# Altium project prj.PrjPcb
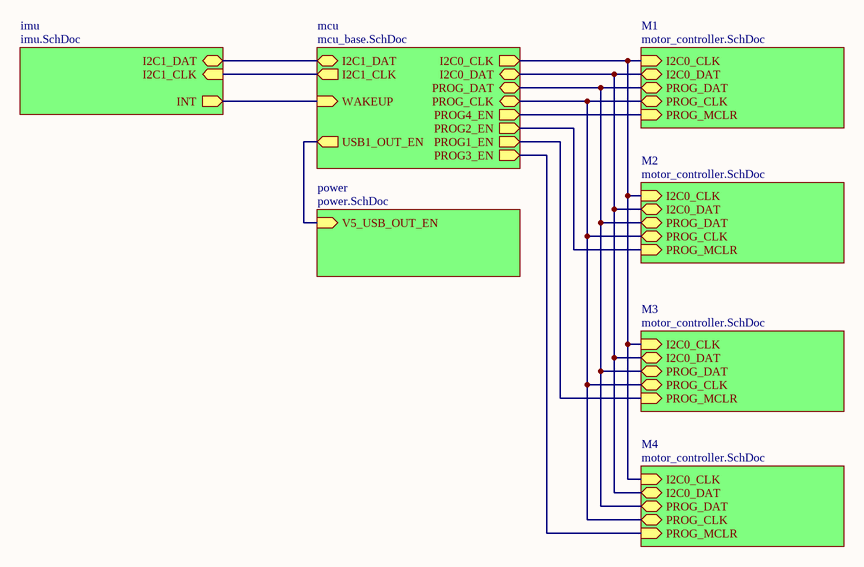
[diagram p0: top.SchDoc]
5 sheets, 197 parts. Net scope: hierarchical (ports join the sheet entries above them; power ports are global).
Board file: daboard.PcbDoc
Sheets:
  top.SchDoc
    M1 = motor_controller.SchDoc
    mcu = mcu_base.SchDoc
    imu = imu.SchDoc
    power = power.SchDoc
    M2 = motor_controller.SchDoc
    M3 = motor_controller.SchDoc
    M4 = motor_controller.SchDoc

## Sheet top.SchDoc
size Letter

### Sub-sheets
imu = imu.SchDoc: I2C1_DAT (bidir), I2C1_CLK (in), INT (out)
M1 = motor_controller.SchDoc: I2C0_CLK (in), I2C0_DAT (bidir), PROG_DAT (bidir), PROG_CLK (bidir), PROG_MCLR (in)
M2 = motor_controller.SchDoc: I2C0_CLK (in), I2C0_DAT (bidir), PROG_DAT (bidir), PROG_CLK (bidir), PROG_MCLR (in)
M3 = motor_controller.SchDoc: I2C0_CLK (in), I2C0_DAT (bidir), PROG_DAT (bidir), PROG_CLK (bidir), PROG_MCLR (in)
M4 = motor_controller.SchDoc: I2C0_CLK (in), I2C0_DAT (bidir), PROG_DAT (bidir), PROG_CLK (bidir), PROG_MCLR (in)
mcu = mcu_base.SchDoc: I2C1_CLK (out), I2C1_DAT (bidir), I2C0_DAT (bidir), I2C0_CLK (out), USB1_OUT_EN (out), PROG1_EN (out), PROG2_EN (out), PROG3_EN (out), PROG4_EN (out), PROG_DAT (bidir), PROG_CLK (bidir), WAKEUP (in)
power = power.SchDoc: V5_USB_OUT_EN (in)

### Nets
NetR11A_2: sheet M1/PROG_MCLR, sheet mcu/PROG4_EN
NetR11B_2: sheet mcu/PROG2_EN, sheet M2/PROG_MCLR
NetR11C_2: sheet mcu/PROG1_EN, sheet M3/PROG_MCLR
NetR11D_2: sheet mcu/PROG3_EN, sheet M4/PROG_MCLR
NetR31_2: sheet mcu/USB1_OUT_EN, sheet power/V5_USB_OUT_EN
NetR32_1: sheet mcu/I2C1_DAT, sheet imu/I2C1_DAT
NetR33_1: sheet mcu/I2C1_CLK, sheet imu/I2C1_CLK
NetR34_1: sheet M1/I2C0_CLK, sheet mcu/I2C0_CLK, sheet M2/I2C0_CLK, sheet M3/I2C0_CLK, sheet M4/I2C0_CLK
NetR35_1: sheet M1/I2C0_DAT, sheet mcu/I2C0_DAT, sheet M2/I2C0_DAT, sheet M3/I2C0_DAT, sheet M4/I2C0_DAT
NetU2_50: sheet M1/PROG_DAT, sheet mcu/PROG_DAT, sheet M2/PROG_DAT, sheet M3/PROG_DAT, sheet M4/PROG_DAT
NetU2_51: sheet M1/PROG_CLK, sheet mcu/PROG_CLK, sheet M2/PROG_CLK, sheet M3/PROG_CLK, sheet M4/PROG_CLK
NetU2_130: sheet mcu/WAKEUP, sheet imu/INT

## Sheet motor_controller.SchDoc: Brushless Motor Controller
size Letter
Used 4 times, as channels M1, M2, M3, M4. Parts and nets are listed once, with the designators drawn on the sheet.
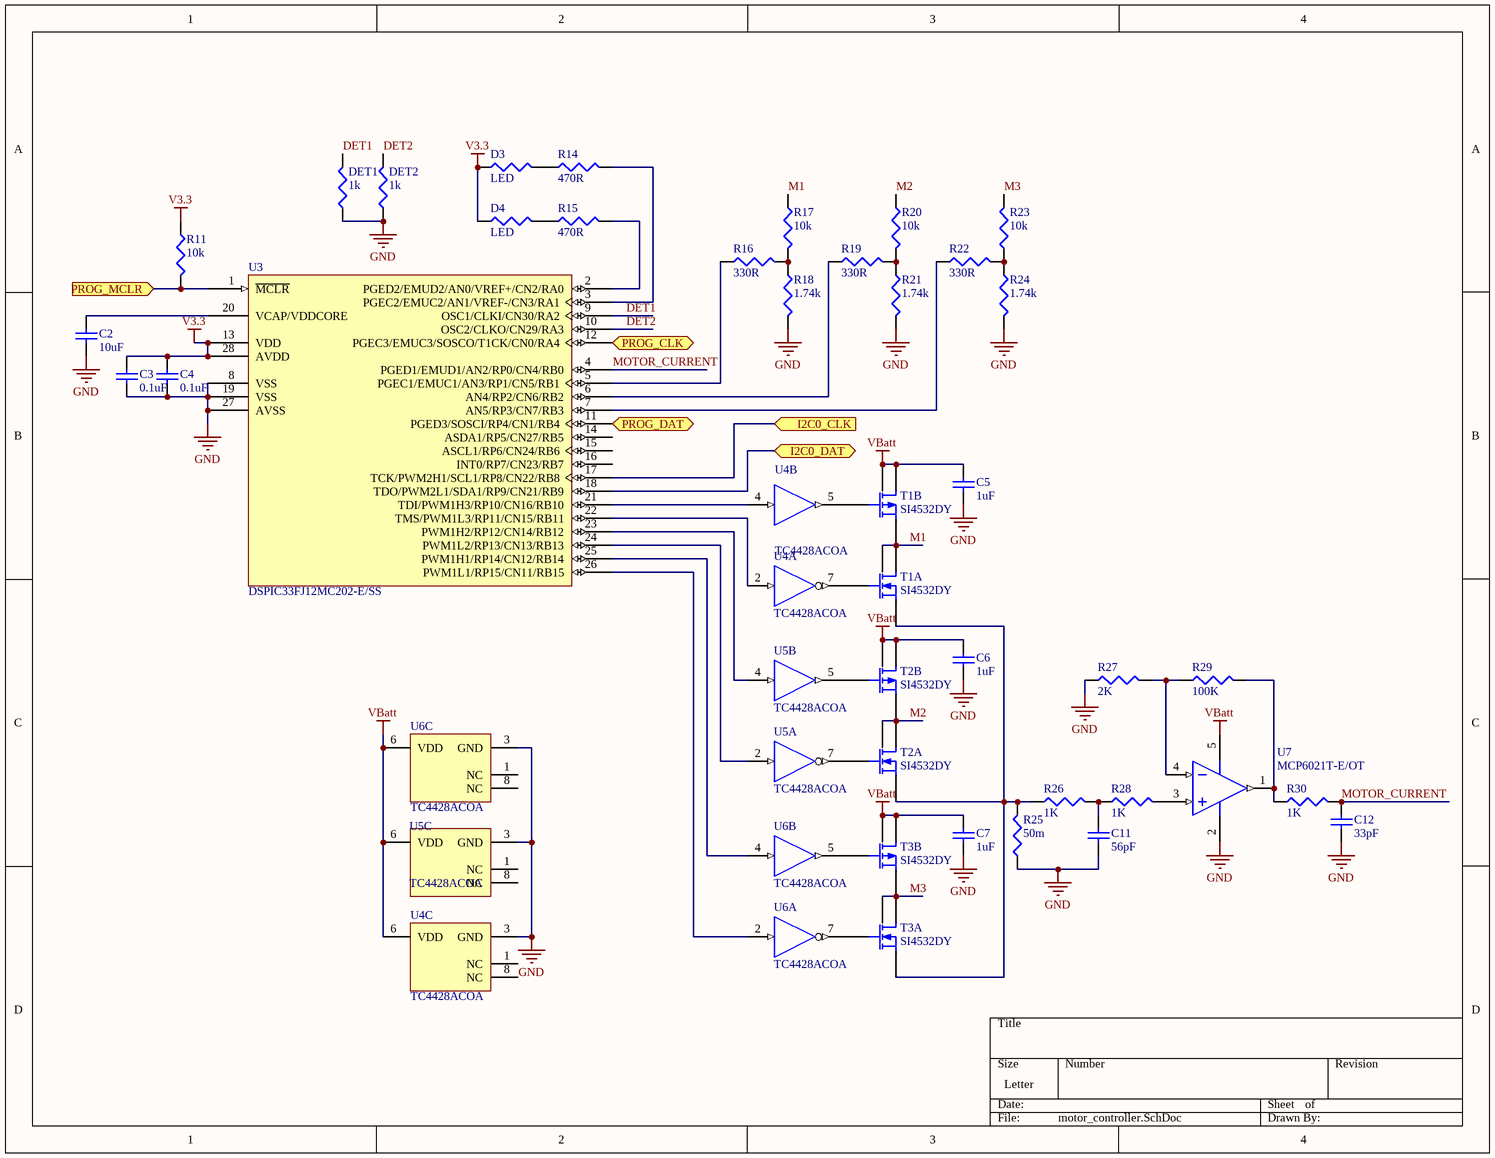
[diagram p1: motor_controller.SchDoc]

### Parts
C2  10uF  [1608[0603]]
C3  0.1uF  [1608[0603]]
C4  0.1uF  [1608[0603]]
C5  1uF  [1608[0603]]
C6  1uF  [1608[0603]]
C7  1uF  [1608[0603]]
C11  56pF  [1608[0603]]
C12  33pF  [1608[0603]]
D3  LED  [J1-0603]
D4  LED  [J1-0603]
DET1  1k  [J1-0603]
DET2  1k  [J1-0603]
R11  10k  [J1-0603]
R14  470R  [J1-0603]
R15  470R  [J1-0603]
R16  330R  [J1-0603]
R17  10k  [J1-0603]
R18  1.74k  [J1-0603]
R19  330R  [J1-0603]
R20  10k  [J1-0603]
R21  1.74k  [J1-0603]
R22  330R  [J1-0603]
R23  10k  [J1-0603]
R24  1.74k  [J1-0603]
R25  50m  [14-1210]
R26  1K  [J1-0603]
R27  2K  [J1-0603]
R28  1K  [J1-0603]
R29  100K  [J1-0603]
R30  1K  [J1-0603]
T1  SI4532DY  [SOIC127P600-8L]  (parts A,B of 2)
T2  SI4532DY  [SOIC127P600-8L]  (parts A,B of 2)
T3  SI4532DY  [SOIC127P600-8L]  (parts A,B of 2)
U3  DSPIC33FJ12MC202-E/SS  [SSOP-SS28_N]
U4  TC4428ACOA  [SOIC-OA8_N]  (parts A,B,C of 3)
U5  TC4428ACOA  [SOIC-OA8_N]  (parts A,B,C of 3)
U6  TC4428ACOA  [SOIC-OA8_N]  (parts A,B,C of 3)
U7  MCP6021T-E/OT  [SOT-23-OT5_N]

### Ports
I2C0_CLK (in), I2C0_DAT (bidir), PROG_CLK (bidir), PROG_DAT (bidir), PROG_MCLR (in)

### Nets
GND: C2.1 C3.1 C4.1 C5.1 C6.1 C7.1 C11.1 C12.1 DET1.1 DET2.1 R18.2 R21.2 R24.2 R25.1 R27.1 U3.8(VSS) U3.19(VSS) U3.27(AVSS) U4.3(GND) U5.3(GND) U6.3(GND) U7.2(VSS)
V3.3: C3.2 C4.2 D3.1 D4.1 R11.1 U3.13(VDD) U3.28(AVDD)
VBatt: C5.2 C6.2 C7.2 T1.5(D2) T1.6(D2) T2.5(D2) T2.6(D2) T3.5(D2) T3.6(D2) U4.6(VDD) U5.6(VDD) U6.6(VDD) U7.5(VDD)
DET1: DET1.2 U3.9(OSC1/CLKI/CN30/RA2)
DET2: DET2.2 U3.10(OSC2/CLKO/CN29/RA3)
I2C0_CLK: U3.17(TCK/PWM2H1/SCL1/RP8/CN22/RB8) ; port I2C0_CLK
I2C0_DAT: U3.18(TDO/PWM2L1/SDA1/RP9/CN21/RB9) ; port I2C0_DAT
M1: R17.1 T1.3(S2) T1.7(D1) T1.8(D1)
M2: R20.1 T2.3(S2) T2.7(D1) T2.8(D1)
M3: R23.2 T3.3(S2) T3.7(D1) T3.8(D1)
MOTOR_CURRENT: C12.2 R30.2 U3.4(PGED1/EMUD1/AN2/RP0/CN4/RB0)
PROG_CLK: U3.12(PGEC3/EMUC3/SOSCO/T1CK/CN0/RA4) ; port PROG_CLK
PROG_DAT: U3.11(PGED3/SOSCI/RP4/CN1/RB4) ; port PROG_DAT
PROG_MCLR: R11.2 U3.1(~{MCLR}) ; port PROG_MCLR
NetC2_2: C2.2 U3.20(VCAP/VDDCORE)
NetC11_2: C11.2 R26.2 R28.1
NetD3_2: D3.2 R14.1
NetD4_2: D4.2 R15.1
NetR14_2: R14.2 U3.3(PGEC2/EMUC2/AN1/VREF-/CN3/RA1)
NetR15_2: R15.2 U3.2(PGED2/EMUD2/AN0/VREF+/CN2/RA0)
NetR16_1: R16.1 U3.5(PGEC1/EMUC1/AN3/RP1/CN5/RB1)
NetR16_2: R16.2 R17.2 R18.1
NetR19_1: R19.1 U3.6(AN4/RP2/CN6/RB2)
NetR19_2: R19.2 R20.2 R21.1
NetR22_1: R22.1 U3.7(AN5/RP3/CN7/RB3)
NetR22_2: R22.2 R23.1 R24.1
NetR25_2: R25.2 R26.1 T1.1(S1) T2.1(S1) T3.1(S1)
NetR27_2: R27.2 R29.1 U7.4(VIN-)
NetR28_2: R28.2 U7.3(VIN+)
NetR29_2: R29.2 R30.1 U7.1(VOUT)
NetT1_2: T1.2(G1) U4.7(~{OUTA})
NetT1_4: T1.4(G2) U4.5(OUTB)
NetT2_2: T2.2(G1) U5.7(~{OUTA})
NetT2_4: T2.4(G2) U5.5(OUTB)
NetT3_2: T3.2(G1) U6.7(~{OUTA})
NetT3_4: T3.4(G2) U6.5(OUTB)
NetU3_21: U3.21(TDI/PWM1H3/RP10/CN16/RB10) U4.4(INB)
NetU3_22: U3.22(TMS/PWM1L3/RP11/CN15/RB11) U4.2(INA)
NetU3_23: U3.23(PWM1H2/RP12/CN14/RB12) U5.4(INB)
NetU3_24: U3.24(PWM1L2/RP13/CN13/RB13) U5.2(INA)
NetU3_25: U3.25(PWM1H1/RP14/CN12/RB14) U6.4(INB)
NetU3_26: U3.26(PWM1L1/RP15/CN11/RB15) U6.2(INA)

Not connected (* = marked no-connect by the designer): U3 14(ASDA1/RP5/CN27/RB5) 15(ASCL1/RP6/CN24/RB6) 16(INT0/RP7/CN23/RB7); U4 1(NC) 8(NC); U5 1(NC) 8(NC); U6 1(NC) 8(NC)

### Channels
M1: designators end in A; ports I2C0_CLK=NetR34_1 I2C0_DAT=NetR35_1 PROG_CLK=NetU2_51 PROG_DAT=NetU2_50 PROG_MCLR=NetR11A_2
M2: designators end in B; ports I2C0_CLK=NetR34_1 I2C0_DAT=NetR35_1 PROG_CLK=NetU2_51 PROG_DAT=NetU2_50 PROG_MCLR=NetR11B_2
M3: designators end in C; ports I2C0_CLK=NetR34_1 I2C0_DAT=NetR35_1 PROG_CLK=NetU2_51 PROG_DAT=NetU2_50 PROG_MCLR=NetR11C_2
M4: designators end in D; ports I2C0_CLK=NetR34_1 I2C0_DAT=NetR35_1 PROG_CLK=NetU2_51 PROG_DAT=NetU2_50 PROG_MCLR=NetR11D_2

### Library data of the parts
C2-C7 C11 C12 = Cap Semi: Capacitor (Semiconductor SIM Model); Value: 100pF; Published: 8-Jun-2000; LatestRevisionDate: 29-May-2009; LatestRevisionNote: IPC-7351 Footprint Added.; PackageReference: C1206; Publisher: Altium Limited; PackageDescription: Chip Capacitor
D3 D4 R11 R14-R25 R27 R29 = Res3: Resistor; Value: 1K; Published: 8-Jun-2000; LatestRevisionDate: 29-May-2009; LatestRevisionNote: IPC-7351 Footprint Added.; PackageReference: J1-0603; Publisher: Altium Limited; PackageDescription: Chip Resistor
DET1 DET2 R26 R28 R30 = Res3: Resistor; Published: 8-Jun-2000; LatestRevisionDate: 29-May-2009; LatestRevisionNote: IPC-7351 Footprint Added.; PackageReference: J1-0603; Publisher: Altium Limited; PackageDescription: Chip Resistor; Value: 1K
U3 = DSPIC33FJ12MC202-E/SS: High-Performance 16-bit Digital Signal Controller, 12 KB Flash, 1 KB RAM, 28-Pin SSOP, Extended High Temperature; DatasheetVersion: revD, Jun-2009; PackageVersion: revBB, Aug-2009; PackageReference: SSOP-SS28; PackageDescription: 28-Lead Plastic Shrink Small Outline (SS) - 5.3mm Body [SSOP]; Code_JEDEC: MS-150; ComponentLink1Description: Manufacturer URL; ComponentLink1URL: http://www.microchip.com/; ComponentLink2Description: Datasheet; ComponentLink2URL: http://ww1.microchip.com/downloads/en/DeviceDoc/70265D.pdf; ComponentLink3Description: Package Specification; ComponentLink3URL: http://www.microchip.com/stellent/groups/techpub_sg/documents/packagingspec/en012702.pdf
U4-U6 = TC4428ACOA: 1.5A Dual High-Speed Power MOSFET Driver, Complementary, Commercial Temperature; DatasheetVersion: revF, Jan-2006; PackageVersion: revBB, Aug-2009; PackageReference: SOIC-OA8; PackageDescription: 8-Lead Plastic Small Outline (OA) - Narrow, 3.90mm Body [SOIC]; Code_IPC: SOIC127P600-8; ComponentLink1Description: Manufacturer URL; ComponentLink1URL: http://www.microchip.com/; ComponentLink2Description: Datasheet; ComponentLink2URL: http://ww1.microchip.com/downloads/en/DeviceDoc/21423F.pdf; ComponentLink3Description: Package Specification; ComponentLink3URL: http://www.microchip.com/stellent/groups/techpub_sg/documents/packagingspec/en012702.pdf
U7 = MCP6021T-E/OT: Rail-to-Rail Input/Output, 10 MHz Operational Amplifier, 5-Pin SOT-23, Extended Temperature, Tape and Reel; DatasheetVersion: revD, Feb-2009; PackageVersion: revBB, Aug-2009; PackageReference: SOT-23-OT5; PackageDescription: 5-Lead Plastic Small Outline Transistor (OT) [SOT-23]; Code_IPC: SOT23-5; ComponentLink1Description: Manufacturer URL; ComponentLink1URL: http://www.microchip.com/; ComponentLink2Description: Datasheet; ComponentLink2URL: http://ww1.microchip.com/downloads/en/DeviceDoc/21685d.pdf; ComponentLink3Description: Package Specification; ComponentLink3URL: http://www.microchip.com/stellent/groups/techpub_sg/documents/packagingspec/en012702.pdf

## Sheet mcu_base.SchDoc
size Letter
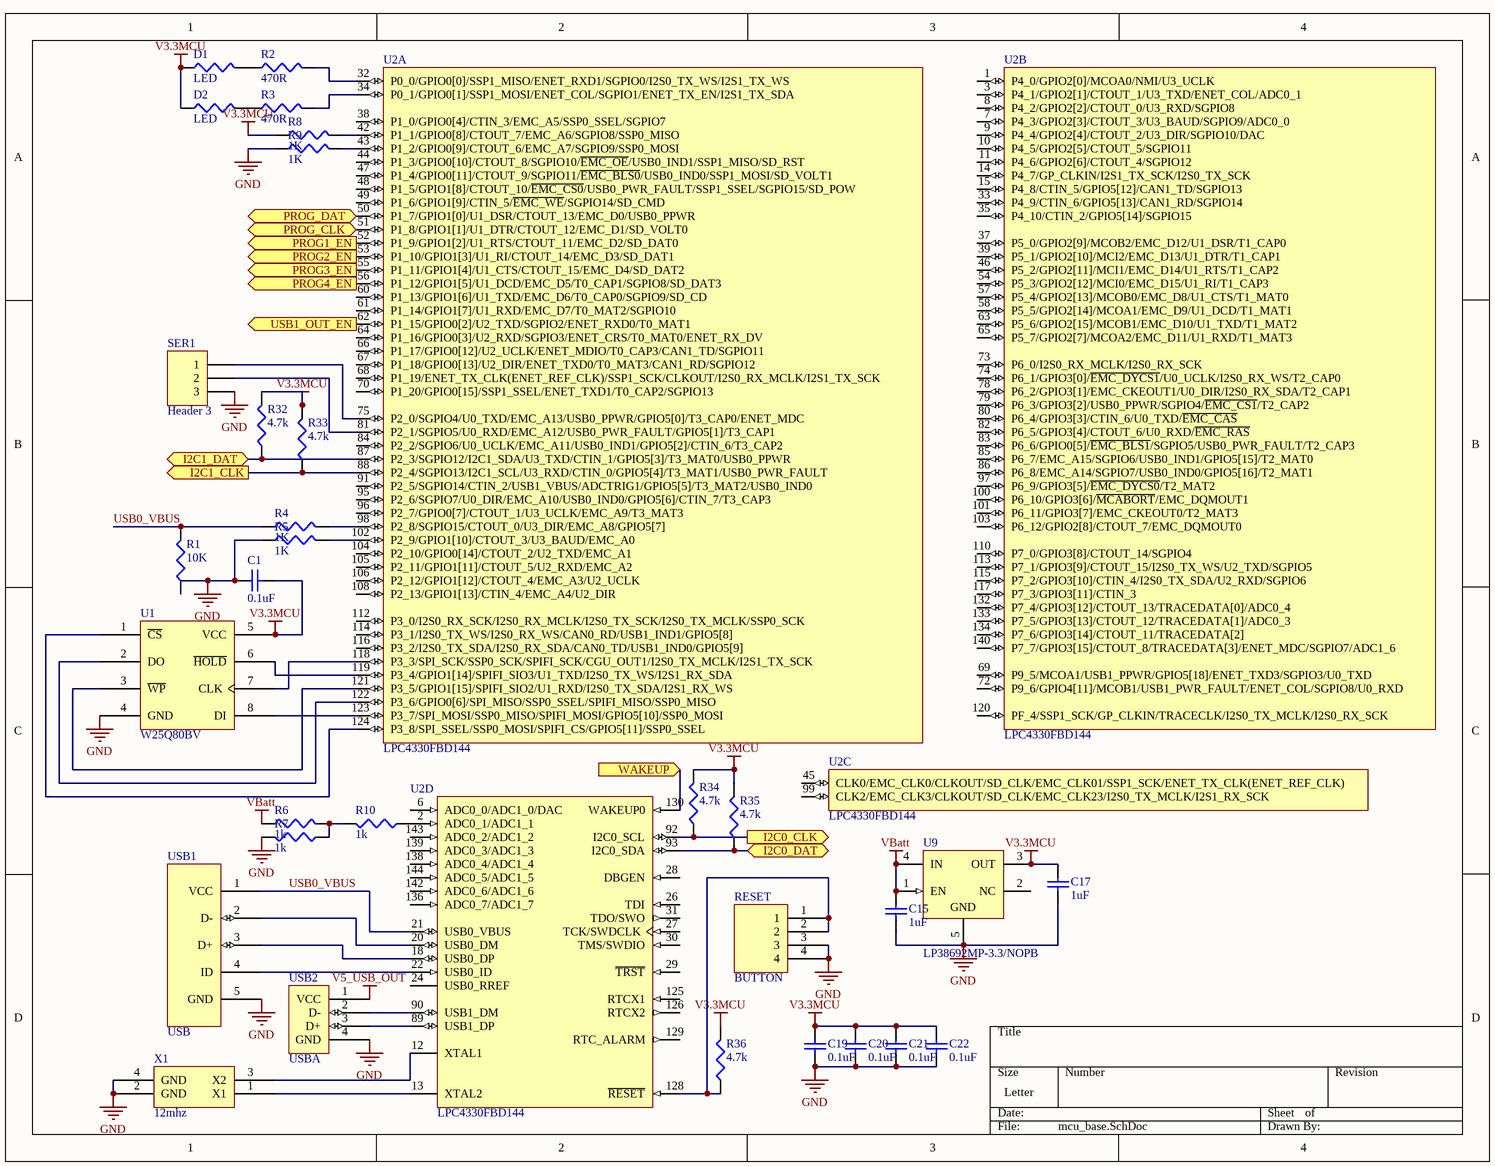
[diagram p2: mcu_base.SchDoc]

### Parts
C1  0.1uF  [1608[0603]]
C15  1uF  [1608[0603]]
C17  1uF  [1608[0603]]
C19  0.1uF  [1608[0603]]
C20  0.1uF  [1608[0603]]
C21  0.1uF  [1608[0603]]
C22  0.1uF  [1608[0603]]
D1  LED  [J1-0603]
D2  LED  [J1-0603]
R1  10K  [J1-0603]
R2  470R  [J1-0603]
R3  470R  [J1-0603]
R4  1K  [J1-0603]
R5  1K  [J1-0603]
R6  1k  [J1-0603]
R7  1k  [J1-0603]
R8  1K  [J1-0603]
R9  1K  [J1-0603]
R10  1k  [J1-0603]
R32  4.7k  [J1-0603]
R33  4.7k  [J1-0603]
R34  4.7k  [J1-0603]
R35  4.7k  [J1-0603]
R36  4.7k  [J1-0603]
RESET  BUTTON  [B3FS_SWITCH]
SER1  Header 3  [HDR1X3]
U1  W25Q80BV  [D8_N]
U2  LPC4330FBD144  [SOT486-1_V]  (parts A,B,C,D of 5)
U9  LP38692MP-3.3/NOPB  [MP05A_N]
USB1  USB  [USB/SM0.8-6H5]
USB2  USBA  [USB2.5-2V4A]
X1  12mhz  [2SMX-3SMXB]

### Ports
I2C0_CLK (out), I2C0_DAT (bidir), I2C1_CLK (out), I2C1_DAT (bidir), PROG1_EN (out), PROG2_EN (out), PROG3_EN (out), PROG4_EN (out), PROG_CLK (bidir), PROG_DAT (bidir), USB1_OUT_EN (out), WAKEUP (in)

### Nets
GND: C1.1 C15.1 C17.1 C19.1 C20.1 C21.1 C22.1 R1.1 R5.1 R7.2 R9.1 RESET.3 RESET.4 SER1.3 U1.4(GND) U9.5(GND) USB1.5(GND) USB2.4(GND) X1.2(GND) X1.4(GND)
V3.3MCU: C1.2 C17.2 C19.2 C20.2 C21.2 C22.2 D1.1 D2.1 R8.1 R32.2 R33.2 R34.2 R35.2 R36.2 U1.5(VCC) U9.3(OUT)
V5_USB_OUT: USB2.1(VCC)
VBatt: C15.2 R6.1 U9.1(EN) U9.4(IN)
USB0_VBUS: R1.2 R4.1 U2.21(USB0_VBUS) USB1.1(VCC)
NetD1_2: D1.2 R2.1
NetD2_2: D2.2 R3.1
NetR2_2: R2.2 U2.32(P0_0/GPIO0[0]/SSP1_MISO/ENET_RXD1/SGPIO0/I2S0_TX_WS/I2S1_TX_WS)
NetR3_2: R3.2 U2.34(P0_1/GPIO0[1]/SSP1_MOSI/ENET_COL/SGPIO1/ENET_TX_EN/I2S1_TX_SDA)
NetR4_2: R4.2 U2.98(P2_8/SGPIO15/CTOUT_0/U3_DIR/EMC_A8/GPIO5[7])
NetR5_2: R5.2 U2.102(P2_9/GPIO1[10]/CTOUT_3/U3_BAUD/EMC_A0)
NetR6_2: R6.2 R7.1 R10.2
NetR8_2: R8.2 U2.42(P1_1/GPIO0[8]/CTOUT_7/EMC_A6/SGPIO8/SSP0_MISO)
NetR9_2: R9.2 U2.43(P1_2/GPIO0[9]/CTOUT_6/EMC_A7/SGPIO9/SSP0_MOSI)
NetR10_1: R10.1 U2.2(ADC0_1/ADC1_1)
NetR11A_2: U2.56(P1_12/GPIO1[5]/U1_DCD/EMC_D5/T0_CAP1/SGPIO8/SD_DAT3) ; port PROG4_EN
NetR11B_2: U2.53(P1_10/GPIO1[3]/U1_RI/CTOUT_14/EMC_D3/SD_DAT1) ; port PROG2_EN
NetR11C_2: U2.52(P1_9/GPIO1[2]/U1_RTS/CTOUT_11/EMC_D2/SD_DAT0) ; port PROG1_EN
NetR11D_2: U2.55(P1_11/GPIO1[4]/U1_CTS/CTOUT_15/EMC_D4/SD_DAT2) ; port PROG3_EN
NetR31_2: U2.62(P1_15/GPIO0[2]/U2_TXD/SGPIO2/ENET_RXD0/T0_MAT1) ; port USB1_OUT_EN
NetR32_1: R32.1 U2.87(P2_3/SGPIO12/I2C1_SDA/U3_TXD/CTIN_1/GPIO5[3]/T3_MAT0/USB0_PPWR) ; port I2C1_DAT
NetR33_1: R33.1 U2.88(P2_4/SGPIO13/I2C1_SCL/U3_RXD/CTIN_0/GPIO5[4]/T3_MAT1/USB0_PWR_FAULT) ; port I2C1_CLK
NetR34_1: R34.1 U2.92(I2C0_SCL) ; port I2C0_CLK
NetR35_1: R35.1 U2.93(I2C0_SDA) ; port I2C0_DAT
NetR36_1: R36.1 RESET.1 RESET.2 U2.128(~{RESET})
NetSER1_1: SER1.1 U2.75(P2_0/SGPIO4/U0_TXD/EMC_A13/USB0_PPWR/GPIO5[0]/T3_CAP0/ENET_MDC)
NetSER1_2: SER1.2 U2.81(P2_1/SGPIO5/U0_RXD/EMC_A12/USB0_PWR_FAULT/GPIO5[1]/T3_CAP1)
NetU1_1: U1.1(~{CS}) U2.124(P3_8/SPI_SSEL/SSP0_MOSI/SPIFI_CS/GPIO5[11]/SSP0_SSEL)
NetU1_2: U1.2(DO) U2.122(P3_6/GPIO0[6]/SPI_MISO/SSP0_SSEL/SPIFI_MISO/SSP0_MISO)
NetU1_3: U1.3(~{WP}) U2.121(P3_5/GPIO1[15]/SPIFI_SIO2/U1_RXD/I2S0_TX_SDA/I2S1_RX_WS)
NetU1_6: U1.6(~{HOLD}) U2.119(P3_4/GPIO1[14]/SPIFI_SIO3/U1_TXD/I2S0_TX_WS/I2S1_RX_SDA)
NetU1_7: U1.7(CLK) U2.118(P3_3/SPI_SCK/SSP0_SCK/SPIFI_SCK/CGU_OUT1/I2S0_TX_MCLK/I2S1_TX_SCK)
NetU1_8: U1.8(DI) U2.123(P3_7/SPI_MOSI/SSP0_MISO/SPIFI_MOSI/GPIO5[10]/SSP0_MOSI)
NetU2_12: U2.12(XTAL1) X1.3(X2)
NetU2_13: U2.13(XTAL2) X1.1(X1)
NetU2_18: U2.18(USB0_DP) USB1.3(D+)
NetU2_20: U2.20(USB0_DM) USB1.2(D-)
NetU2_22: U2.22(USB0_ID) USB1.4(ID)
NetU2_50: U2.50(P1_7/GPIO1[0]/U1_DSR/CTOUT_13/EMC_D0/USB0_PPWR) ; port PROG_DAT
NetU2_51: U2.51(P1_8/GPIO1[1]/U1_DTR/CTOUT_12/EMC_D1/SD_VOLT0) ; port PROG_CLK
NetU2_89: U2.89(USB1_DP) USB2.3(D+)
NetU2_90: U2.90(USB1_DM) USB2.2(D-)
NetU2_130: U2.130(WAKEUP0) ; port WAKEUP

Not connected (* = marked no-connect by the designer): U2 1(P4_0/GPIO2[0]/MCOA0/NMI/U3_UCLK) 3(P4_1/GPIO2[1]/CTOUT_1/U3_TXD/ENET_COL/ADC0_1) 6(ADC0_0/ADC1_0/DAC) 7(P4_3/GPIO2[3]/CTOUT_3/U3_BAUD/SGPIO9/ADC0_0) 8(P4_2/GPIO2[2]/CTOUT_0/U3_RXD/SGPIO8) 9(P4_4/GPIO2[4]/CTOUT_2/U3_DIR/SGPIO10/DAC) 10(P4_5/GPIO2[5]/CTOUT_5/SGPIO11) 11(P4_6/GPIO2[6]/CTOUT_4/SGPIO12) 14(P4_7/GP_CLKIN/I2S1_TX_SCK/I2S0_TX_SCK) 15(P4_8/CTIN_5/GPIO5[12]/CAN1_TD/SGPIO13) 24(USB0_RREF) 26(TDI) 27(TCK/SWDCLK) 28(DBGEN) 29(~{TRST}) 30(TMS/SWDIO) 31(TDO/SWO) 33(P4_9/CTIN_6/GPIO5[13]/CAN1_RD/SGPIO14) 35(P4_10/CTIN_2/GPIO5[14]/SGPIO15) 37(P5_0/GPIO2[9]/MCOB2/EMC_D12/U1_DSR/T1_CAP0) 38(P1_0/GPIO0[4]/CTIN_3/EMC_A5/SSP0_SSEL/SGPIO7) 39(P5_1/GPIO2[10]/MCI2/EMC_D13/U1_DTR/T1_CAP1) 44(P1_3/GPIO0[10]/CTOUT_8/SGPIO10/~{EMC_OE}/USB0_IND1/SSP1_MISO/SD_RST) 45(CLK0/EMC_CLK0/CLKOUT/SD_CLK/EMC_CLK01/SSP1_SCK/ENET_TX_CLK(ENET_REF_CLK)) 46(P5_2/GPIO2[11]/MCI1/EMC_D14/U1_RTS/T1_CAP2) 47(P1_4/GPIO0[11]/CTOUT_9/SGPIO11/~{EMC_BLS0}/USB0_IND0/SSP1_MOSI/SD_VOLT1) 48(P1_5/GPIO1[8]/CTOUT_10/~{EMC_CS0}/USB0_PWR_FAULT/SSP1_SSEL/SGPIO15/SD_POW) 49(P1_6/GPIO1[9]/CTIN_5/~{EMC_WE}/SGPIO14/SD_CMD) 54(P5_3/GPIO2[12]/MCI0/EMC_D15/U1_RI/T1_CAP3) 57(P5_4/GPIO2[13]/MCOB0/EMC_D8/U1_CTS/T1_MAT0) 58(P5_5/GPIO2[14]/MCOA1/EMC_D9/U1_DCD/T1_MAT1) 60(P1_13/GPIO1[6]/U1_TXD/EMC_D6/T0_CAP0/SGPIO9/SD_CD) 61(P1_14/GPIO1[7]/U1_RXD/EMC_D7/T0_MAT2/SGPIO10) 63(P5_6/GPIO2[15]/MCOB1/EMC_D10/U1_TXD/T1_MAT2) 64(P1_16/GPIO0[3]/U2_RXD/SGPIO3/ENET_CRS/T0_MAT0/ENET_RX_DV) 65(P5_7/GPIO2[7]/MCOA2/EMC_D11/U1_RXD/T1_MAT3) 66(P1_17/GPIO0[12]/U2_UCLK/ENET_MDIO/T0_CAP3/CAN1_TD/SGPIO11) 67(P1_18/GPIO0[13]/U2_DIR/ENET_TXD0/T0_MAT3/CAN1_RD/SGPIO12) 68(P1_19/ENET_TX_CLK(ENET_REF_CLK)/SSP1_SCK/CLKOUT/I2S0_RX_MCLK/I2S1_TX_SCK) 69(P9_5/MCOA1/USB1_PPWR/GPIO5[18]/ENET_TXD3/SGPIO3/U0_TXD) 70(P1_20/GPIO0[15]/SSP1_SSEL/ENET_TXD1/T0_CAP2/SGPIO13) 72(P9_6/GPIO4[11]/MCOB1/USB1_PWR_FAULT/ENET_COL/SGPIO8/U0_RXD) 73(P6_0/I2S0_RX_MCLK/I2S0_RX_SCK) 74(P6_1/GPIO3[0]/~{EMC_DYCS1}/U0_UCLK/I2S0_RX_WS/T2_CAP0) 78(P6_2/GPIO3[1]/EMC_CKEOUT1/U0_DIR/I2S0_RX_SDA/T2_CAP1) 79(P6_3/GPIO3[2]/USB0_PPWR/SGPIO4/~{EMC_CS1}/T2_CAP2) 80(P6_4/GPIO3[3]/CTIN_6/U0_TXD/~{EMC_CAS}) 82(P6_5/GPIO3[4]/CTOUT_6/U0_RXD/~{EMC_RAS}) 83(P6_6/GPIO0[5]/~{EMC_BLS1}/SGPIO5/USB0_PWR_FAULT/T2_CAP3) 84(P2_2/SGPIO6/U0_UCLK/EMC_A11/USB0_IND1/GPIO5[2]/CTIN_6/T3_CAP2) 85(P6_7/EMC_A15/SGPIO6/USB0_IND1/GPIO5[15]/T2_MAT0) 86(P6_8/EMC_A14/SGPIO7/USB0_IND0/GPIO5[16]/T2_MAT1) 91(P2_5/SGPIO14/CTIN_2/USB1_VBUS/ADCTRIG1/GPIO5[5]/T3_MAT2/USB0_IND0) 95(P2_6/SGPIO7/U0_DIR/EMC_A10/USB0_IND0/GPIO5[6]/CTIN_7/T3_CAP3) 96(P2_7/GPIO0[7]/CTOUT_1/U3_UCLK/EMC_A9/T3_MAT3) 97(P6_9/GPIO3[5]/~{EMC_DYCS0}/T2_MAT2) 99(CLK2/EMC_CLK3/CLKOUT/SD_CLK/EMC_CLK23/I2S0_TX_MCLK/I2S1_RX_SCK) 100(P6_10/GPIO3[6]/~{MCABORT}/EMC_DQMOUT1) 101(P6_11/GPIO3[7]/EMC_CKEOUT0/T2_MAT3) 103(P6_12/GPIO2[8]/CTOUT_7/EMC_DQMOUT0) 104(P2_10/GPIO0[14]/CTOUT_2/U2_TXD/EMC_A1) 105(P2_11/GPIO1[11]/CTOUT_5/U2_RXD/EMC_A2) 106(P2_12/GPIO1[12]/CTOUT_4/EMC_A3/U2_UCLK) 108(P2_13/GPIO1[13]/CTIN_4/EMC_A4/U2_DIR) 110(P7_0/GPIO3[8]/CTOUT_14/SGPIO4) 112(P3_0/I2S0_RX_SCK/I2S0_RX_MCLK/I2S0_TX_SCK/I2S0_TX_MCLK/SSP0_SCK) 113(P7_1/GPIO3[9]/CTOUT_15/I2S0_TX_WS/U2_TXD/SGPIO5) 114(P3_1/I2S0_TX_WS/I2S0_RX_WS/CAN0_RD/USB1_IND1/GPIO5[8]) 115(P7_2/GPIO3[10]/CTIN_4/I2S0_TX_SDA/U2_RXD/SGPIO6) 116(P3_2/I2S0_TX_SDA/I2S0_RX_SDA/CAN0_TD/USB1_IND0/GPIO5[9]) 117(P7_3/GPIO3[11]/CTIN_3) 120(PF_4/SSP1_SCK/GP_CLKIN/TRACECLK/I2S0_TX_MCLK/I2S0_RX_SCK) 125(RTCX1) 126(RTCX2) 129(RTC_ALARM) 132(P7_4/GPIO3[12]/CTOUT_13/TRACEDATA[0]/ADC0_4) 133(P7_5/GPIO3[13]/CTOUT_12/TRACEDATA[1]/ADC0_3) 134(P7_6/GPIO3[14]/CTOUT_11/TRACEDATA[2]) 136(ADC0_7/ADC1_7) 138(ADC0_4/ADC1_4) 139(ADC0_3/ADC1_3) 140(P7_7/GPIO3[15]/CTOUT_8/TRACEDATA[3]/ENET_MDC/SGPIO7/ADC1_6) 142(ADC0_6/ADC1_6) 143(ADC0_2/ADC1_2) 144(ADC0_5/ADC1_5); U9 2(NC)

### Library data of the parts
C1 C15 C17 C19-C22 = Cap Semi: as C2 on sheet motor_controller; Published: 8-Jun-2000; LatestRevisionDate: 29-May-2009; LatestRevisionNote: IPC-7351 Footprint Added.; PackageReference: C1206; Publisher: Altium Limited; PackageDescription: Chip Capacitor
D1 D2 R1-R3 R32-R36 = Res3: Resistor; Value: 1K; Published: 8-Jun-2000; LatestRevisionDate: 29-May-2009; LatestRevisionNote: IPC-7351 Footprint Added.; PackageReference: J1-0603; Publisher: Altium Limited; PackageDescription: Chip Resistor
R4-R10 = Res3: Resistor; Published: 8-Jun-2000; LatestRevisionDate: 29-May-2009; LatestRevisionNote: IPC-7351 Footprint Added.; PackageReference: J1-0603; Publisher: Altium Limited; PackageDescription: Chip Resistor; Value: 1K
SER1 = Header 3: Header, 3-Pin; LatestRevisionDate: 17-Jul-2002; LatestRevisionNote: Re-released for DXP Platform.; Publisher: Altium Limited
U2 = LPC4330FBD144: 32-bit ARM Cortex-M4 MCU, 264 kB SRAM, 2 HS USB with on-chip PHY, Ethernet, CAN, AES, SPIFI, SGPIO, SCT, 144-Pin LQFP; fmax: 204 MHz; GPIOs: 83; SRAM: 264 kB; ROM: 64 kB; Ethernet: Y; USB: 2; ADC channels: 8; SPI: 1; UART: 4; VDD (min): 2.2 V; VDD (max): 3.6 V; Code_IEC: 136E23; DatasheetVersion: Rev.3.1, Jan-2012; PackageVersion: Feb-2003; PackageReference: SOT486-1; PackageDescription: LQFP144: Plastic Low Profile Quad Flat Package; 144 Leads; Body 20 x 20 x 1.4 mm; PWM: Y; PLL: Y; I2C: 2; CAN: 2; Timers: 4; Code_JEDEC: MS-026; ComponentLink1Description: Manufacturer URL; ComponentLink1URL: http://www.nxp.com/; ComponentLink2Description: Datasheet; ComponentLink2URL: http://www.nxp.com/documents/data_sheet/LPC4350_30_20_10.pdf
U9 = LP38692MP-3.3/NOPB: 1A Low Dropout CMOS Linear Regulators, Stable with Ceramic Output Capacitors, 5-pin SOT-223, Pb-Free; Manufacturer: National Semiconductor; PackageTopMarking: XYTT*LJSB; PowerWise: Y; CompType: LDO IC; DatasheetVersion: May-2005; PackageVersion: revA, Jan-2000; PackageReference: MP05A; PackageDescription: Moldec SOT-223, 6.50 x 3.56 x 1.6mm Body, 5 Lead, 1.5mm Pitch; PartNumber: LP38692MP-3.3/NOPB; RoHS: Y; PinCount: 5; High-Reliability: Y; Code_JEDEC: TO-261-AB; Code_IPC: SOT223-5; ComponentLink1Description: Manufacturer URL; ComponentLink1URL: http://www.national.com/; ComponentLink2Description: LP38692 Datasheet; ComponentLink2URL: http://www.national.com/ds/LP/LP38692.pdf; ComponentLink3Description: LP38692 Web Page; ComponentLink3URL: http://www.national.com/pf/LP/LP38692.html; ComponentLink4Description: MP05A Package Page; ComponentLink4URL: http://www.national.com/packaging/folders/mp05a.html
X1 = crystal

## Sheet imu.SchDoc
size Letter
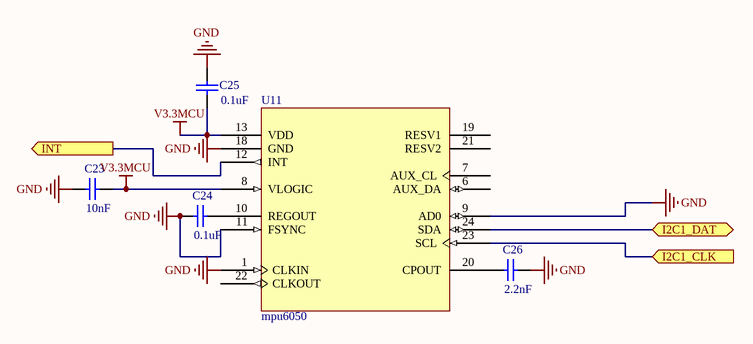
[diagram p3: imu.SchDoc]

### Parts
C23  value 10nF  [1608[0603]]
C24  value 0.1uF  [1608[0603]]
C25  value 0.1uF  [1608[0603]]
C26  value 2.2nF  [1608[0603]]
U11  mpu6050  [QFN-24_N]

### Ports
I2C1_CLK (in), I2C1_DAT (bidir), INT (out)

### Nets
GND: C23.1 C24.1 C25.2 C26.2 U11.1(CLKIN) U11.9(AD0) U11.11(FSYNC) U11.18(GND)
V3.3MCU: C23.2 C25.1 U11.8(VLOGIC) U11.13(VDD)
NetC24_2: C24.2 U11.10(REGOUT)
NetC26_1: C26.1 U11.20(CPOUT)
NetR32_1: U11.24(SDA) ; port I2C1_DAT
NetR33_1: U11.23(SCL) ; port I2C1_CLK
NetU2_130: U11.12(INT) ; port INT

Not connected (* = marked no-connect by the designer): U11 6(AUX_DA) 7(AUX_CL) 19(RESV1) 21(RESV2) 22(CLKOUT)

### Library data of the parts
C23-C26 = Cap Semi: Capacitor (Semiconductor SIM Model); Published: 8-Jun-2000; LatestRevisionDate: 29-May-2009; LatestRevisionNote: IPC-7351 Footprint Added.; PackageReference: C1206; Publisher: Altium Limited; PackageDescription: Chip Capacitor

## Sheet power.SchDoc
size Letter
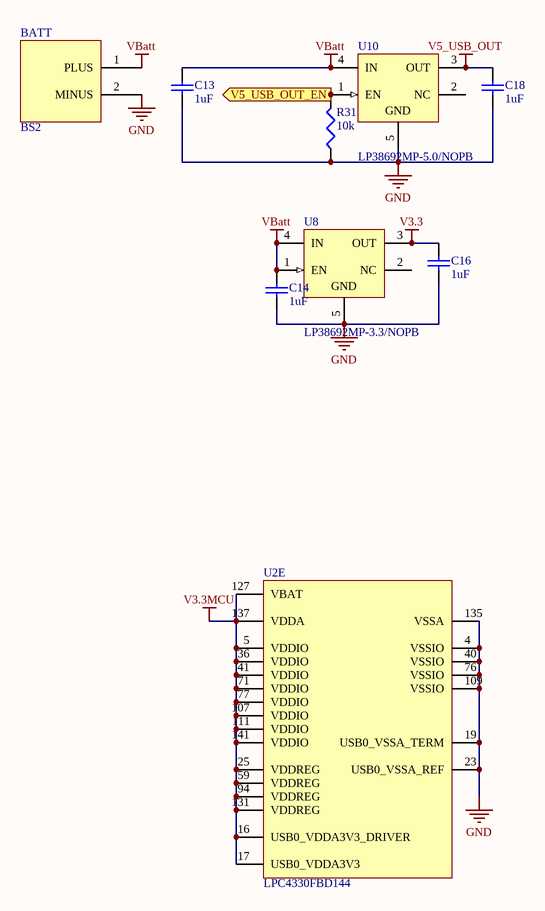
[diagram p4: power.SchDoc]

### Parts
BATT  BS2  [PCBComponent_1]
C13  1uF  [1608[0603]]
C14  1uF  [1608[0603]]
C16  1uF  [1608[0603]]
C18  1uF  [1608[0603]]
R31  10k  [J1-0603]
U2  LPC4330FBD144  [SOT486-1_V]  (part E of 5)
U8  LP38692MP-3.3/NOPB  [MP05A_N]
U10  LP38692MP-5.0/NOPB  [MP05A_N]

### Ports
V5_USB_OUT_EN (in)

### Nets
GND: BATT.2(MINUS) C13.1 C14.1 C16.1 C18.1 R31.1 U2.4(VSSIO) U2.19(USB0_VSSA_TERM) U2.23(USB0_VSSA_REF) U2.40(VSSIO) U2.76(VSSIO) U2.109(VSSIO) U2.135(VSSA) U8.5(GND) U10.5(GND)
V3.3: C16.2 U8.3(OUT)
V3.3MCU: U2.5(VDDIO) U2.16(USB0_VDDA3V3_DRIVER) U2.17(USB0_VDDA3V3) U2.25(VDDREG) U2.36(VDDIO) U2.41(VDDIO) U2.59(VDDREG) U2.71(VDDIO) U2.77(VDDIO) U2.94(VDDREG) U2.107(VDDIO) U2.111(VDDIO) U2.127(VBAT) U2.131(VDDREG) U2.137(VDDA) U2.141(VDDIO)
V5_USB_OUT: C18.2 U10.3(OUT)
VBatt: BATT.1(PLUS) C13.2 C14.2 U8.1(EN) U8.4(IN) U10.4(IN)
NetR31_2: R31.2 U10.1(EN) ; port V5_USB_OUT_EN

Not connected (* = marked no-connect by the designer): U8 2(NC); U10 2(NC)

### Library data of the parts
C13 C14 C16 C18 = Cap Semi: as C2 on sheet motor_controller; Published: 8-Jun-2000; LatestRevisionDate: 29-May-2009; LatestRevisionNote: IPC-7351 Footprint Added.; PackageReference: C1206; Publisher: Altium Limited; PackageDescription: Chip Capacitor
R31 = Res3: Resistor; Value: 1K; Published: 8-Jun-2000; LatestRevisionDate: 29-May-2009; LatestRevisionNote: IPC-7351 Footprint Added.; PackageReference: J1-0603; Publisher: Altium Limited; PackageDescription: Chip Resistor
U2 = LPC4330FBD144: as U2 on sheet mcu_base; DatasheetVersion: Rev.3.1, Jan-2012; PackageVersion: Feb-2003; PackageReference: SOT486-1; PackageDescription: LQFP144: Plastic Low Profile Quad Flat Package; 144 Leads; Body 20 x 20 x 1.4 mm; PWM: Y; PLL: Y; I2C: 2; CAN: 2; Timers: 4; Code_JEDEC: MS-026; ComponentLink1Description: Manufacturer URL; ComponentLink1URL: http://www.nxp.com/; ComponentLink2Description: Datasheet; ComponentLink2URL: http://www.nxp.com/documents/data_sheet/LPC4350_30_20_10.pdf
U8 = LP38692MP-3.3/NOPB: as U9 on sheet mcu_base; DatasheetVersion: May-2005; PackageVersion: revA, Jan-2000; PackageReference: MP05A; PackageDescription: Moldec SOT-223, 6.50 x 3.56 x 1.6mm Body, 5 Lead, 1.5mm Pitch; PartNumber: LP38692MP-3.3/NOPB; RoHS: Y; PinCount: 5; High-Reliability: Y; Code_JEDEC: TO-261-AB; Code_IPC: SOT223-5; ComponentLink1Description: Manufacturer URL; ComponentLink1URL: http://www.national.com/; ComponentLink2Description: LP38692 Datasheet; ComponentLink2URL: http://www.national.com/ds/LP/LP38692.pdf; ComponentLink3Description: LP38692 Web Page; ComponentLink3URL: http://www.national.com/pf/LP/LP38692.html; ComponentLink4Description: MP05A Package Page; ComponentLink4URL: http://www.national.com/packaging/folders/mp05a.html
U10 = LP38692MP-5.0/NOPB: 1A Low Dropout CMOS Linear Regulators, Stable with Ceramic Output Capacitors, 5-pin SOT-223, Pb-Free; Manufacturer: National Semiconductor; PackageTopMarking: XYTT*LJTB; PowerWise: Y; CompType: LDO IC; DatasheetVersion: May-2005; PackageVersion: revA, Jan-2000; PackageReference: MP05A; PackageDescription: Moldec SOT-223, 6.50 x 3.56 x 1.6mm Body, 5 Lead, 1.5mm Pitch; PartNumber: LP38692MP-5.0/NOPB; RoHS: Y; PinCount: 5; High-Reliability: Y; Code_JEDEC: TO-261-AB; Code_IPC: SOT223-5; ComponentLink1Description: Manufacturer URL; ComponentLink1URL: http://www.national.com/; ComponentLink2Description: LP38692 Datasheet; ComponentLink2URL: http://www.national.com/ds/LP/LP38692.pdf; ComponentLink3Description: LP38692 Web Page; ComponentLink3URL: http://www.national.com/pf/LP/LP38692.html; ComponentLink4Description: MP05A Package Page; ComponentLink4URL: http://www.national.com/packaging/folders/mp05a.html

## Nets that join several sheets
GND: M1 (22 pins), mcu_base (20 pins), imu (8 pins), power (15 pins), M2 (22 pins), M3 (22 pins), M4 (22 pins)
V3.3: M1 (7 pins), power (C16.2 U8.3), M2 (7 pins), M3 (7 pins), M4 (7 pins)
V3.3MCU: mcu_base (16 pins), imu (C23.2 C25.1 U11.8 U11.13), power (16 pins)
V5_USB_OUT: mcu_base (USB2.1), power (C18.2 U10.3)
VBatt: M1 (13 pins), mcu_base (C15.2 R6.1 U9.1 U9.4), power (6 pins), M2 (13 pins), M3 (13 pins), M4 (13 pins)
NetR11A_2: M1 (R11A.2 U3A.1), mcu_base (U2.56)
NetR11B_2: mcu_base (U2.53), M2 (R11B.2 U3B.1)
NetR11C_2: mcu_base (U2.52), M3 (R11C.2 U3C.1)
NetR11D_2: mcu_base (U2.55), M4 (R11D.2 U3D.1)
NetR31_2: mcu_base (U2.62), power (R31.2 U10.1)
NetR32_1: mcu_base (R32.1 U2.87), imu (U11.24)
NetR33_1: mcu_base (R33.1 U2.88), imu (U11.23)
NetR34_1: M1 (U3A.17), mcu_base (R34.1 U2.92), M2 (U3B.17), M3 (U3C.17), M4 (U3D.17)
NetR35_1: M1 (U3A.18), mcu_base (R35.1 U2.93), M2 (U3B.18), M3 (U3C.18), M4 (U3D.18)
NetU2_50: M1 (U3A.11), mcu_base (U2.50), M2 (U3B.11), M3 (U3C.11), M4 (U3D.11)
NetU2_51: M1 (U3A.12), mcu_base (U2.51), M2 (U3B.12), M3 (U3C.12), M4 (U3D.12)
NetU2_130: mcu_base (U2.130), imu (U11.12)